# EAGLE design tvbgone (EAGLE 7.3.0)
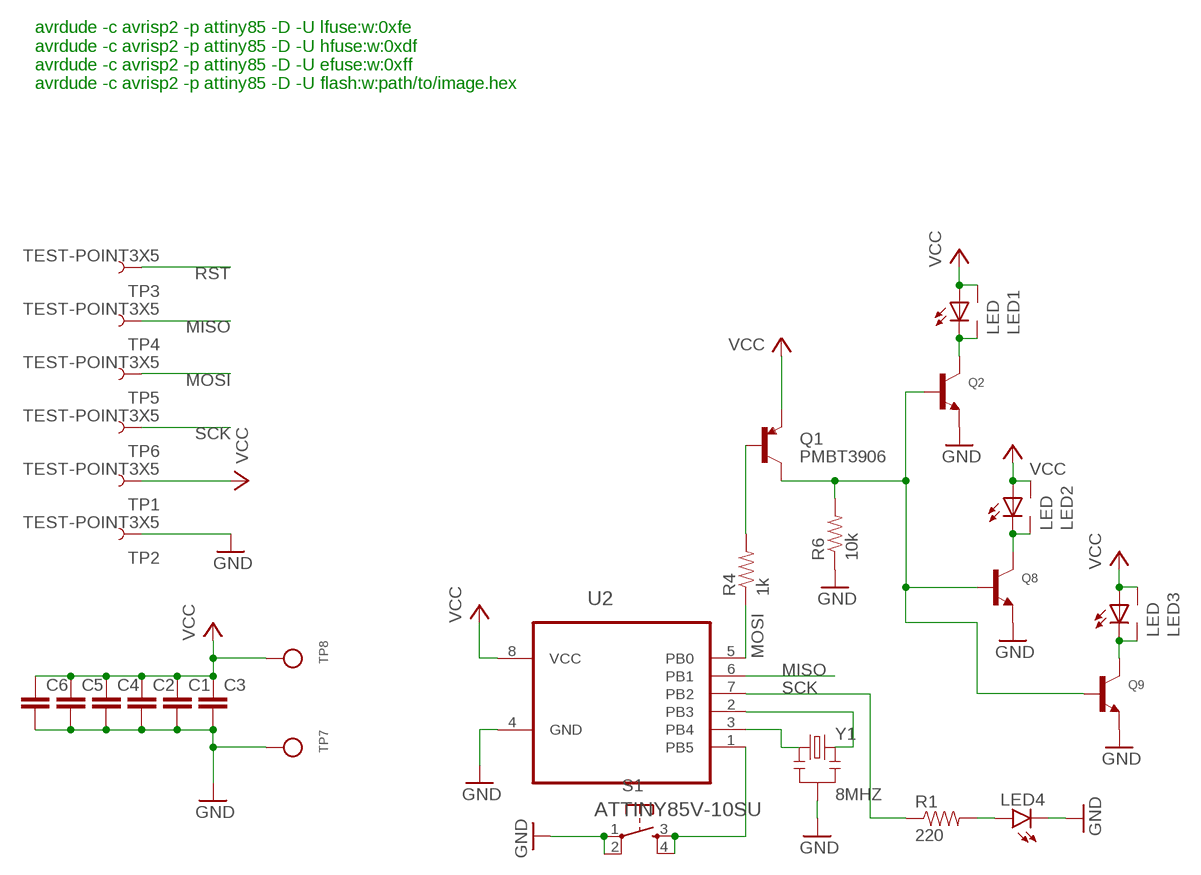
[diagram p0: schematic, sheet 1]

## Parts
C1  CAP0603-CAP  [0603-CAP]
C2  CAP0603-CAP  [0603-CAP]
C3  CAP0603-CAP  [0603-CAP]
C4  CAP0603-CAP  [0603-CAP]
C5  CAP0603-CAP  [0603-CAP]
C6  CAP0603-CAP  [0603-CAP]
LED1  LED  [5MM-SIDE]
LED2  LED  [5MM-SIDE]
LED3  LED  [5MM-SIDE]
LED4  LED0603  [LED-0603]
Q1  PMBT3906  TRANSISTOR_PNPPMBT3906  [SOT23-3]
Q2  TRANSISTOR_NPN  [SOT-23-R]
Q8  TRANSISTOR_NPN  [SOT-23-R]
Q9  TRANSISTOR_NPN  [SOT-23-R]
R1  220  RESISTOR0603  [0603-RES]
R4  1k  RESISTOR0603  [0603-RES]
R6  10k  RESISTOR0603  [0603-RES]
S1  TAC_SWITCHSMD  [TACTILE-SWITCH-SMD]
TP1  TEST-POINT3X5  [PAD.03X.05]
TP2  TEST-POINT3X5  [PAD.03X.05]
TP3  TEST-POINT3X5  [PAD.03X.05]
TP4  TEST-POINT3X5  [PAD.03X.05]
TP5  TEST-POINT3X5  [PAD.03X.05]
TP6  TEST-POINT3X5  [PAD.03X.05]
TP7  TESTPOINTPAD  [TESTPOINT_PAD_2MM]
TP8  TESTPOINTPAD  [TESTPOINT_PAD_2MM]
U2  ATTINY85V-10SU  [SOIC127P798X216-8N]
Y1  8MHZ  RESONATOR8MHZ  [RESONATOR-SMD]

## Nets
GND: C1.2 C2.2 C3.2 C4.2 C5.2 C6.2 LED4.C Q2.3-EMITTER(E) Q8.3-EMITTER(E) Q9.3-EMITTER(E) R6.1 S1.1 S1.2 TP2.P$1 TP7.P$1 U2.4(GND) Y1.2
MISO: TP4.P$1 U2.6(PB1)
MOSI: R4.1 TP5.P$1 U2.5(PB0)
N$1: U2.3(PB4) Y1.1
N$2: U2.2(PB3) Y1.3
N$3: LED4.A R1.2
N$4: LED1.K2(C1) LED1.K(C) Q2.2-COLLECTOR(C)
N$5: LED2.K2(C1) LED2.K(C) Q8.2-COLLECTOR(C)
N$6: Q1.1(B) R4.2
N$7: LED3.K2(C1) LED3.K(C) Q9.2-COLLECTOR(C)
N$10: Q1.3(C) Q2.1-BASE(B) Q8.1-BASE(B) Q9.1-BASE(B) R6.2
RST: S1.3 S1.4 TP3.P$1 U2.1(PB5)
SCK: R1.1 TP6.P$1 U2.7(PB2)
VCC: C1.1 C2.1 C3.1 C4.1 C5.1 C6.1 LED1.A LED1.A2(A1) LED2.A LED2.A2(A1) LED3.A LED3.A2(A1) Q1.2(E) TP1.P$1 TP8.P$1 U2.8(VCC)

## Notes on the sheet
- avrdude -c avrisp2 -p attiny85 -D -U lfuse:w:0xfe
  avrdude -c avrisp2 -p attiny85 -D -U hfuse:w:0xdf
  avrdude -c avrisp2 -p attiny85 -D -U efuse:w:0xff
  avrdude -c avrisp2 -p attiny85 -D -U flash:w:path/to/image.hex

## Library data of the parts
C1-C6 = homemade-hardware:CAP: Capacitor Standard 0603 ceramic capacitor, and 0.1" leaded capacitor.
LED1-LED3 = tvbgone:LED
LED4 = homemade-hardware:LED: LEDs Standard schematic elements and footprints for 5mm, 3mm, 1206, and 0603 sized LEDs. 5mm - Spark Fun Electronics SKU : COM-00529 (and others)
Q1 = SparkFun-DiscreteSemi:TRANSISTOR_PNP: Generic PNP BJT Double check pinouts against datasheets- not all devices are the same! MMBT3906 - 40V 200mA SOT-23 (TRANS-08052) MMBT4403 - 40V 600mA SOT-23 (TRANS-09245); PROD_ID: TRANS-08052
Q2 Q8 Q9 = Tomorrow_Lab_LLC:TRANSISTOR_NPN: NPN Transistor Transistor (NPN) 500mA 45V - BC817 [Digikey: 568-1631-1-ND] SOT23-R - SOT23 footprint optimised for use with solder paste and reflow ovens. SOT23-W - SOT23 footprint optimised for hand-soldering (larger pads).
R1 R4 R6 = homemade-hardware:RESISTOR: Resistor Basic schematic elements and footprints for 0603, 1206, and PTH resistors.
S1 = SparkFun-Electromechanical:TAC_SWITCH: Momentary Switch Button commonly used for reset or general input. Spark Fun Electronics SKU : COM-00097 SMT- SWCH-08247
TP1-TP6 = SparkFun-Passives:TEST-POINT: Bare copper test points for troubleshooting or ICT
TP7 TP8 = microbuilder:TESTPOINT: Test Point Various test points for characterisation and PCB testing TESTPOINT_SMT - Compact Surface Mount Test Point [Digikey: 5016KTR-ND]
U2 = Atmel_By_element14_Batch_1:ATTINY85V-10SU: 8-bit Microcontroller with In-System Programmable Flash; MPN: ATTINY85V-10SU; OC_FARNELL: 1455166; OC_NEWARK: 58M3799; PACKAGE: SOIC-8; SUPPLIER: Atmel
Y1 = homemade-hardware:RESONATOR: Resonator Small SMD resonator. Used, eg, on the Arduino Pro/ Pro Mini boards. 8MHz- XTAL-08895 16MHz- XTAL-08900; PROD_ID: XTAL-08895

## Board
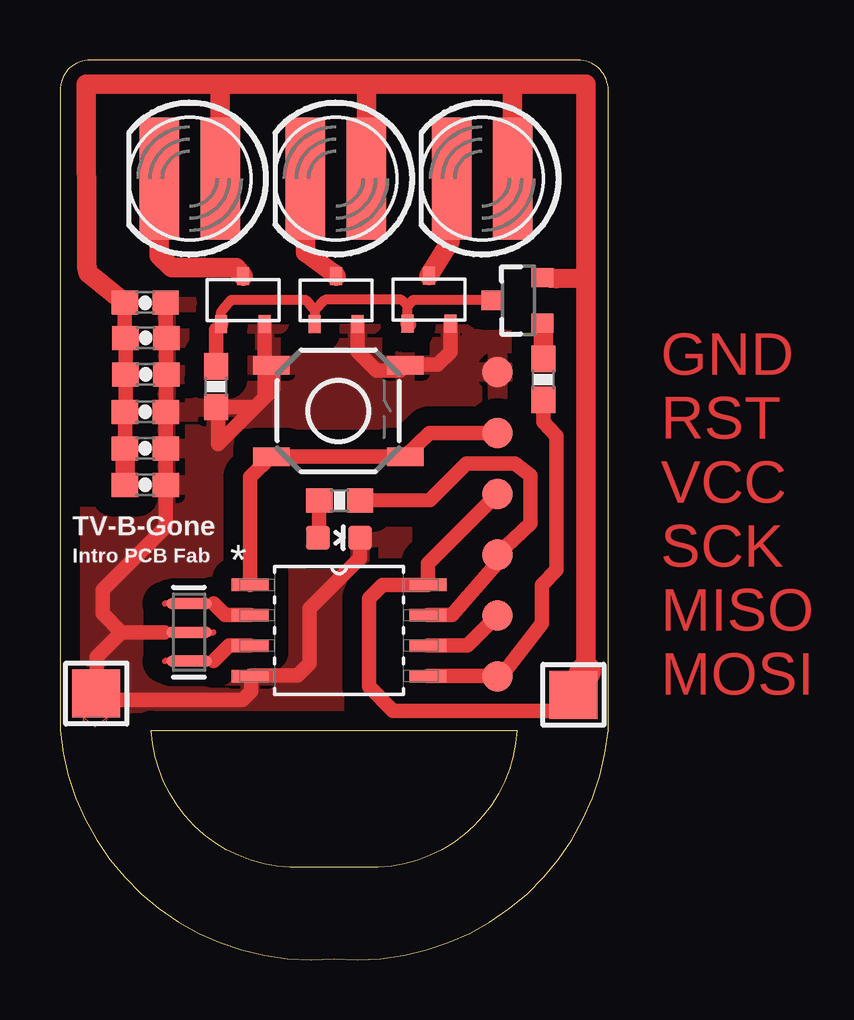
[diagram p1: board, top side]
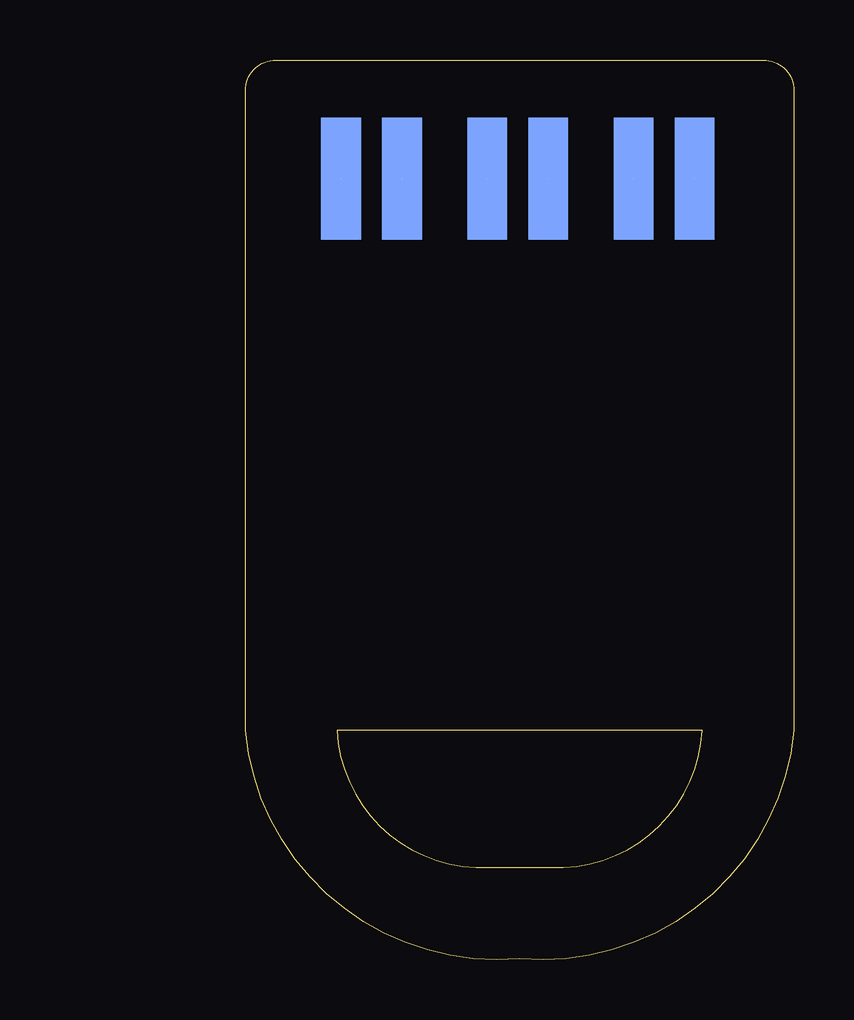
[diagram p2: board, bottom side, seen from below]

Size 22.86 x 37.51 mm. Coordinates in mm from the lower left corner, seen from the top.
Outline: 0,36.24 0,9.57 arc90 11.43,0.04 arc90 22.86,9.57 22.86,36.24 arc90 21.59,37.51 1.27,37.51 arc90 0,36.24
Outline: 19.05,9.57 arc-90 12.7,3.85 10.16,3.85 arc-90 3.81,9.57 19.05,9.57
Copper layers (1*16): Top 0.035mm / dielectric 1.5mm / Bottom 0.035mm
Design rules "default *": minimum track width 10mil, minimum drill 20mil, track to track 12mil, track to pad 12mil, pad to pad 12mil, via to via 12mil, smd to smd 0mil, copper to edge 10mil, drill to drill 8mil, minimum pad ring 10mil, minimum via ring 8mil, stop-mask expansion 4mil, vias tented up to drill 0mil, thermal gap 10mil

### Footprints (pad centres in the part's own frame; a part is rotated, then mirrored left to right if it is on the bottom)
0603-CAP = smd 1.1 x 1: 1 -0.85,0; 2 0.85,0
5MM-SIDE = smd 1.651 x 5.08: A -1.27,0; K 1.27,0 | smd 1.651 x 5.08 bottom: A2 -1.27,0; K2 1.27,0
LED-0603 = smd 1 x 1: A 0,-0.877; C 0,0.877
SOT23-3 = smd 0.8 x 0.9: 1 -0.95,-1; 2 0.95,-1; 3 0,1.1
SOT-23-R = smd 0.5 x 0.75: 1-BASE -0.9,-1; 2-COLLECTOR 0,1; 3-EMITTER 0.9,-1
0603-RES = smd 1.1 x 1: 1 -0.85,0; 2 0.85,0
TACTILE-SWITCH-SMD = smd 1.524 x 0.762: 1 -2.794,1.905; 2 2.794,1.905; 3 -2.794,-1.905; 4 2.794,-1.905
PAD.03X.05 = smd 1.27 x 1.27: P$1 0,0
TESTPOINT_PAD_2MM = smd 2 x 2: P$1 0,0
SOIC127P798X216-8N = smd 1.549 x 0.533: 1 -3.708,1.905; 2 -3.708,0.635; 3 -3.708,-0.635; 4 -3.708,-1.905; 5 3.708,-1.905; 6 3.708,-0.635; 7 3.708,0.635; 8 3.708,1.905
RESONATOR-SMD = smd 0.45 x 1.905: 1 -1.2,0; 2 0,0; 3 1.2,0

### Placement (x,y rotation side)
C1  3.56,21.32 0 top
C2  3.56,22.84 0 top
C3  3.56,19.79 0 top
C4  3.56,27.39 0 top
C5  3.58,25.92 0 top
C6  3.58,24.4 0 top
LED1  17.6,32.56 180 top
LED2  5.41,32.56 180 top
LED3  11.51,32.56 180 top
LED4  11.63,17.59 270 top
Q1  19.11,27.49 90 top
Q2  15.38,27.52 0 top
Q8  7.63,27.49 0 top
Q9  11.51,27.49 0 top
R1  11.66,19.14 180 top
R4  20.15,24.19 90 top
R6  6.51,23.89 90 top
S1  11.6,22.87 0 top
TP1  18.24,19.42 180 top
TP2  18.24,24.5 180 top
TP3  18.24,21.96 0 top
TP4  18.24,14.34 90 top
TP5  18.24,11.8 90 top
TP6  18.24,16.88 90 top
TP7  1.52,11.1 90 top
TP8  21.41,11.05 90 top
U2  11.64,13.73 0 top
Y1  5.38,13.65 90 top

### Tracks (layer width: path | path; a pad name or v marks a point on that pad's centre or on a via)
GND
  Top 0.61: C4.2 4.41,25.95 C5.2 C6.2 4.43,22.86 C2.2 4.41,18.04 1.78,15.41 1.78,14.43 2.56,13.65 | LED4.C 12.51,16.74 10.41,14.65 10.41,12.36 9.91,11.85 7.96,11.85 | 7.96,11.85 U2.4 | 4.37,13.65 2.56,13.65 | 2.56,13.65 1.52,12.62 TP7.P$1 1.78,10.84 7.62,10.84 7.96,11.18 7.96,11.85 | S1.1 8.89,24.7 8.89,23.79 8.13,23.04 R6.1 6.6,22.94 6.6,21.51 8.53,23.43 Q8.3-EMITTER | Q9.3-EMITTER 12.41,25.36 13.21,24.55 14.17,24.55 S1.2 14.42,24.81 15.75,24.81 16.28,25.34 Q2.3-EMITTER
  pour Top (isolate 0.813): 0.33,28.85 23.19,28.85 23.19,9.8 0.33,9.8
MISO
  Top 0.61: U2.6 16.99,13.09 TP4.P$1
MOSI
  Top 0.406: 18.39,11.8 18.26,11.82 TP5.P$1
  Top 0.61: U2.5 18.22,11.82 TP5.P$1 | R4.1 20.15,22.41 20.7,21.84 20.7,16.25 20.09,15.61 20.09,14.01 18.39,11.8
N$1
  Top 0.61: U2.3 7.04,13.09 6.4,12.45
N$2
  Top 0.61: U2.2 6.89,14.36 6.4,14.85
N$3
  Top 0.406: 10.81,17.62 LED4.A
  Top 0.61: R1.2 10.81,17.62
N$4  (1 unrouted)
  Top 0.813: LED1.K2 16.27,29.94 Q2.2-COLLECTOR
N$5  (1 unrouted)
  Top 0.813: LED2.K2 4.14,29.36 4.65,28.85 7.34,28.85 Q8.2-COLLECTOR
N$6
  Top 0.406: 20.15,26.5 Q1.1
  Top 0.813: R4.2 20.15,26.5
N$7  (1 unrouted)
  Top 0.813: LED3.K2 10.24,29.48 11.43,28.59 Q9.2-COLLECTOR
N$8
  Top 0: 1.94,9.92 1.97,10.1 1.46,9.7 0.96,10.1 0.98,9.92 0.98,10.83 0.98,10.81 0.98,11.43 1,11.14 1.46,11.26 1.92,11.14 1.94,11.43 1.94,10.81 1.94,10.83
N$10
  Top 0.406: Q2.1-BASE 14.48,27.27 | 14.48,27.27 14.24,27.51 11.06,27.51 10.62,27.07 | 10.62,27.07 10.62,26.52 Q9.1-BASE | Q8.1-BASE 6.73,27.03 6.8,27.11 7.15,27.51 10.24,27.51 10.62,27.07 | 14.48,27.27 14.5,27.27 14.69,27.49 Q1.3
  Top 0.61: 14.55,26.47 Q2.1-BASE | R6.2 6.51,26.28 Q8.1-BASE
RST
  Top 0.61: U2.1 7.93,20.13 S1.3 S1.4 15.41,21.96 TP3.P$1
SCK
  Top 0.406: TP6.P$1
  Top 0.61: U2.7 16.35,14.36 18.16,16.45 18.26,16.86 TP6.P$1 | R1.1 15.42,19.17 16.94,20.69 18.97,20.69 19.61,20.19 19.61,18.18 TP6.P$1
VCC  (3 unrouted)
  Top 0.61: TP8.P$1 20.59,10.38 13.89,10.38 12.88,11.4 12.88,15.05 13.46,15.63 U2.8 15.35,16.53 TP1.P$1 | C4.1 2.71,25.95 C5.1 C6.1 2.73,22.86 C2.1 C1.1
  Top 0.813: 18.87,36.5 21.92,36.5 21.92,28.42 | 18.87,36.5 12.78,36.5 | 12.78,36.5 6.68,36.5 | 6.68,36.5 1.09,36.5 1.1,28.91 1.17,28.61 C4.1 | LED2.A2 6.68,36.5 | LED3.A 12.78,36.5 | LED1.A 18.87,36.5 | 21.92,12.05 21.92,28.42 | Q1.2 20.7,28.39 21.92,28.42 | C1.1 C3.1
  Top 1.27: 21.92,12.05 TP8.P$1

### Text on the board
Top: GND / RST / VCC / SCK / MISO / MOSI
tNames: TV-B-Gone | Intro PCB Fab